# EAGLE design ma732_adapter (EAGLE 9.6.0)
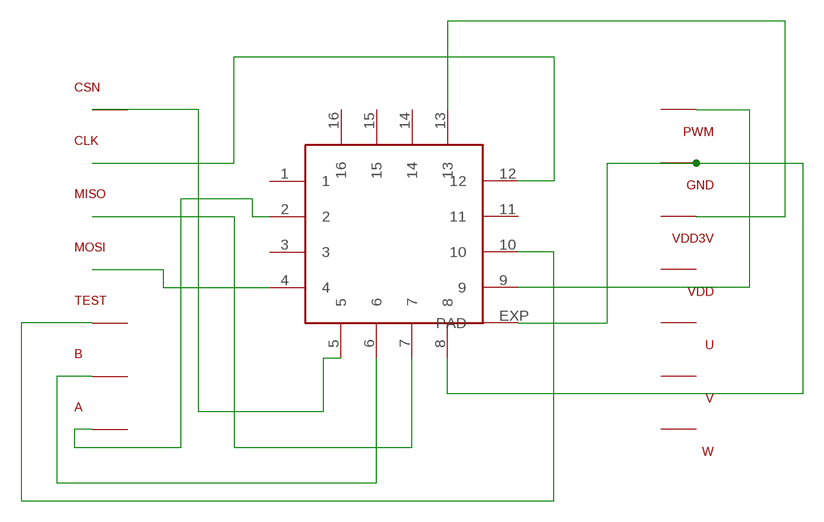
[diagram p0: schematic, sheet 1]

## Parts
A  TSSOP_PAD  [TSSOP_PAD]
B  TSSOP_PAD  [TSSOP_PAD]
CLK  TSSOP_PAD  [TSSOP_PAD]
CSN  TSSOP_PAD  [TSSOP_PAD]
GND  TSSOP_PAD  [TSSOP_PAD]
MISO  TSSOP_PAD  [TSSOP_PAD]
MOSI  TSSOP_PAD  [TSSOP_PAD]
PWM  TSSOP_PAD  [TSSOP_PAD]
TEST  TSSOP_PAD  [TSSOP_PAD]
U  TSSOP_PAD  [TSSOP_PAD]
U$1  QFN16-BO  [QFN16]
V  TSSOP_PAD  [TSSOP_PAD]
VDD  TSSOP_PAD  [TSSOP_PAD]
VDD3V  TSSOP_PAD  [TSSOP_PAD]
W  TSSOP_PAD  [TSSOP_PAD]

## Nets
N$15: CSN.P$1 U$1.5
N$16: CLK.P$1 U$1.12
N$17: MISO.P$1 U$1.7
N$18: MOSI.P$1 U$1.4
N$19: TEST.P$1 U$1.10
N$20: B.P$1 U$1.6
N$21: A.P$1 U$1.2
N$22: PWM.P$1 U$1.9
N$23: GND.P$1 U$1.8 U$1.EXP(PAD)
N$24: U$1.13 VDD3V.P$1
Unconnected: U$1.1 U$1.3 U$1.11 U$1.14 U$1.15 U$1.16 U.P$1 V.P$1 VDD.P$1 W.P$1

## Library data of the parts
A B CLK CSN GND MISO MOSI PWM TEST U V VDD VDD3V W = ma732_adapter:TSSOP_PAD
U$1 = ma732_adapter:QFN16-BO

## Board
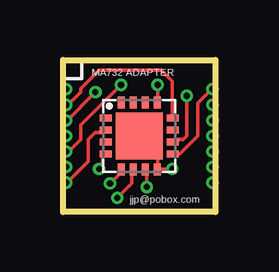
[diagram p1: board, top side]
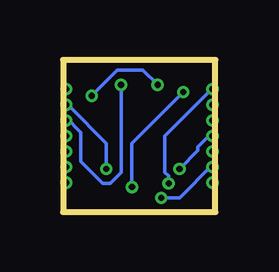
[diagram p2: board, bottom side, seen from below]

Size 6.35 x 6.35 mm. Coordinates in mm from the lower left corner, seen from the top.
Outline: 0,6.35 6.35,6.35 6.35,0 0,0 0,6.35
Copper layers (1*16): Top 0.035559375mm / dielectric 1.6mm / Bottom 0.035559375mm
Design rules "oshpark-2layer *": minimum track width 6mil, minimum drill 10mil, track to track 6mil, track to pad 6mil, pad to pad 5mil, via to via 5mil, smd to smd 6mil, copper to edge 0mil, drill to drill 6mil, minimum pad ring 5mil, minimum via ring 5mil, stop-mask expansion 2.5mil, vias tented up to drill 0mil, thermal gap 10mil

### Footprints (pad centres in the part's own frame; a part is rotated, then mirrored left to right if it is on the bottom)
TSSOP_PAD = drill 0.254: P$1 0,0
QFN16 = smd 0.5 x 0.3: 1 -1.4,0.75; 2 -1.4,0.25; 3 -1.4,-0.25; 4 -1.4,-0.75; 9 1.4,-0.75; 10 1.4,-0.25; 11 1.4,0.25; 12 1.4,0.75 | smd 0.3 x 0.5: 5 -0.75,-1.4; 6 -0.25,-1.4; 7 0.25,-1.4; 8 0.75,-1.4; 13 0.75,1.4; 14 0.25,1.4; 15 -0.25,1.4; 16 -0.75,1.4 | smd 1.95 x 1.95: EXP 0,0

### Placement (x,y rotation side)
A  0.12,1.22 0 top
B  0.12,1.87 0 top
CLK  0.12,4.47 0 top
CSN  0.12,5.12 0 top
GND  6.22,4.47 0 top
MISO  0.12,3.82 0 top
MOSI  0.12,3.17 0 top
PWM  6.22,5.12 0 top
TEST  0.12,2.52 0 top
U  6.22,2.52 0 top
U$1  3.17,3.17 0 top
V  6.22,1.87 0 top
VDD  6.22,3.17 0 top
VDD3V  6.22,3.82 0 top
W  6.22,1.22 0 top

### Tracks (layer width: path | path; a pad name or v marks a point on that pad's centre or on a via)
N$15  (via drill 0.25)
  Top 0.152: v1.96,1.19 2.41,1.65 U$1.5
  Bottom 0.152: v1.96,1.19 1.96,1.5 2.11,1.65 2.11,3.17 0.13,5.16 CSN.P$1
N$16
  Top 0.152: U$1.12 4.55,3.94 4.55,5.46 4.09,5.92 1.5,5.92 0.74,5.16 0.74,5 0.13,4.39 CLK.P$1
N$17  (via drill 0.25)
  Top 0.152: v3.48,1.04 3.48,1.65 U$1.7 | v1.35,5 0.13,3.78 MISO.P$1
  Bottom 0.152: v3.48,1.04 3.48,2.87 v1.35,5
N$18  (via drill 0.25)
  Top 0.152: v1.5,1.8 1.65,1.96 1.65,2.41 U$1.4
  Bottom 0.152: v1.5,1.8 0.74,2.56 0.74,2.72 0.28,3.17 MOSI.P$1
N$19  (via drill 0.25)
  Top 0.152: v5.16,4.85 5.16,3.17 5,3.02 4.7,3.02 U$1.10 | v2.41,5.31 0.74,3.63 0.74,3.02 0.13,2.41 TEST.P$1
  Bottom 0.152: v5.16,4.85 4.09,5.92 3.02,5.92 v2.41,5.31
N$20  (via drill 0.25)
  Top 0.152: v2.26,0.58 2.87,1.19 2.87,1.65 U$1.6
  Bottom 0.152: v2.26,0.58 1.5,0.58 0.13,1.96 B.P$1
N$21
  Top 0.152: U$1.2 1.65,3.33 1.35,3.33 1.04,3.02 1.04,2.11 0.13,1.19 A.P$1
N$22
  Top 0.152: U$1.9 4.7,2.41 4.85,2.41 5.61,3.17 5.61,4.55 6.22,5.16 PWM.P$1
N$23  (via drill 0.25)
  Top 0.152: 3.94,1.8 3.94,2.41 U$1.EXP | 3.94,1.8 v4.55,1.8 | 3.94,1.8 U$1.8
  Bottom 0.152: v4.55,1.8 4.55,2.87 6.07,4.39 6.22,4.39 GND.P$1
N$24  (via drill 0.25)
  Top 0.152: v3.94,5.31 3.94,4.7 U$1.13
  Bottom 0.152: v3.94,5.31 3.94,1.65 4.39,1.19 4.7,1.19 5.61,2.11 5.61,3.33 6.22,3.94 VDD3V.P$1

### Text on the board
tPlace: MA732 ADAPTER | jjp@pobox.com